# Altium schematic sheet Sheet2.SchDoc
size A4; SheetNumber: 2; SheetTotal: 2
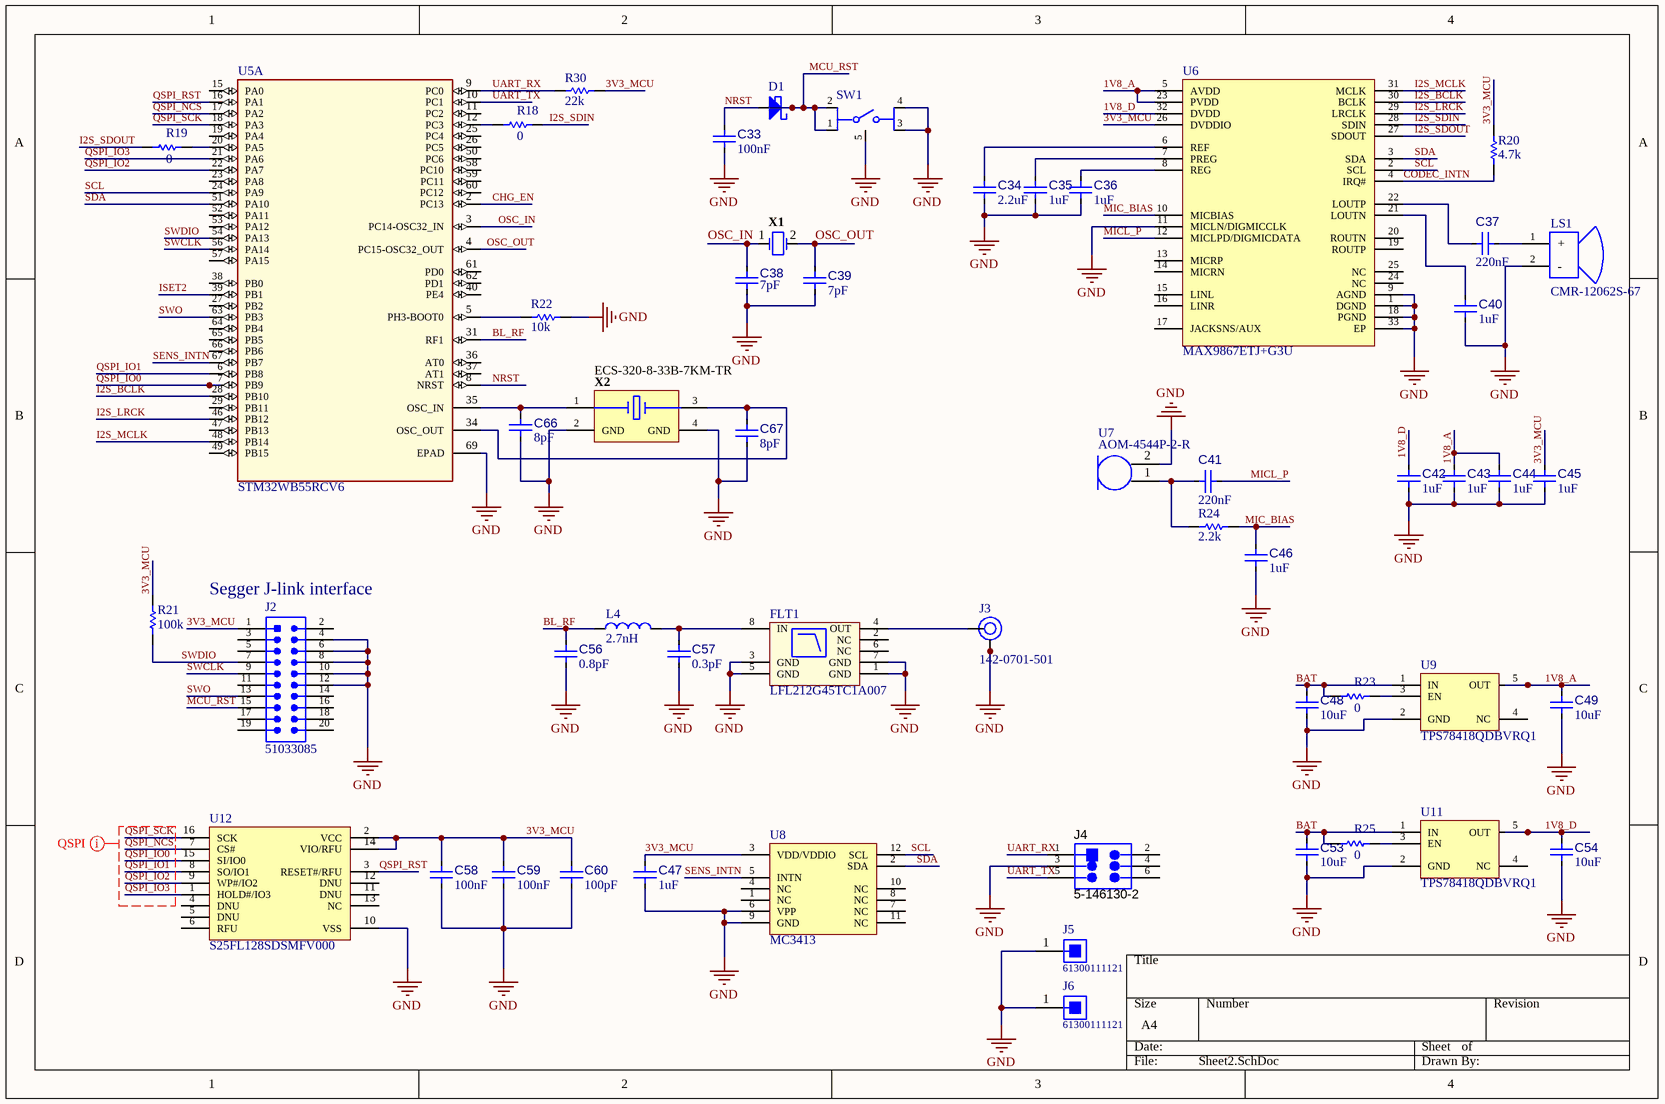
[diagram p0: Sheet2.SchDoc]

## Parts
C33  value 100nF  [0402-SMD-CAP]  (hidden comment: EMF105B7104MVHF)
C34  value 2.2uF  [0603-SMD-CAP]  (hidden comment: GRM188R71A225KE15D)
C35  value 1uF  [0603-SMD-CAP]  (hidden comment: C0603C105K3PACTU)
C36  value 1uF  [0603-SMD-CAP]  (hidden comment: C0603C105K3PACTU)
C37  value 220nF  [0402-SMD-CAP]  (hidden comment: GRM155R71C224KA12D)
C38  value 7pF  [0402-SMD-CAP]  (hidden comment: 04025A7R0CAT2A)
C39  value 7pF  [0402-SMD-CAP]  (hidden comment: 04025A7R0CAT2A)
C40  value 1uF  [0603-SMD-CAP]  (hidden comment: C0603C105K3PACTU)
C41  value 220nF  [0402-SMD-CAP]  (hidden comment: GRM155R71C224KA12D)
C42  value 1uF  [0603-SMD-CAP]  (hidden comment: C0603C105K3PACTU)
C43  value 1uF  [0603-SMD-CAP]  (hidden comment: C0603C105K3PACTU)
C44  value 1uF  [0603-SMD-CAP]  (hidden comment: C0603C105K3PACTU)
C45  value 1uF  [0603-SMD-CAP]  (hidden comment: C0603C105K3PACTU)
C46  value 1uF  [0603-SMD-CAP]  (hidden comment: C0603C105K3PACTU)
C47  value 1uF  [0603-SMD-CAP]  (hidden comment: C0603C105K3PACTU)
C48  value 10uF  [0805-SMD-CAP]  (hidden comment: C0805C106K8PACTU)
C49  value 10uF  [0805-SMD-CAP]  (hidden comment: C0805C106K8PACTU)
C53  value 10uF  [0805-SMD-CAP]  (hidden comment: C0805C106K8PACTU)
C54  value 10uF  [0805-SMD-CAP]  (hidden comment: C0805C106K8PACTU)
C56  value 0.8pF  [0402-SMD-CAP]  (hidden comment: GJM1555C1HR80BB01D)
C57  value 0.3pF  [0402-SMD-CAP]  (hidden comment: GJM1555C1HR30WB01D)
C58  value 100nF  [0603-SMD-CAP]  (hidden comment: CC0603KRX7R9BB104)
C59  value 100nF  [0603-SMD-CAP]  (hidden comment: CC0603KRX7R9BB104)
C60  value 100pF  [0402-SMD-CAP]  (hidden comment: 04025A101JAT2A)
C66  value 8pF  [0402-SMD-CAP]  (hidden comment: CGA2B2C0G1H080D050BA)
C67  value 8pF  [0402-SMD-CAP]  (hidden comment: CGA2B2C0G1H080D050BA)
D1  SS12-E3/61T  [VISH-DO-214AC_V]  (value not drawn)
FLT1  LFL212G45TC1A007  [LFL212G45TC1A007-Footprint-1]
J2  51033085  [51033085-Footprint-1]
J3  142-0701-501  [142-0701-501-Footprint-1]
J4  5-146130-2  [TECO-5-146130-2_V]
J5  61300111121  [61300111121]
J6  61300111121  [61300111121]
L4  Inductance: 2.7nH  [0402-SMD-IND]  (hidden comment: LQG15HS2N7S02D)
LS1  CMR-12062S-67  [CMR-12062S-67-Footprint-1]
R18  value 0  [0603-SMD-RES]  (hidden comment: Jumper 0603)
R19  value 0  [0603-SMD-RES]  (hidden comment: Jumper 0603)
R20  value 4.7k  [0603-SMD-RES]  (hidden comment: ERJ-3EKF4701V)
R21  value 100k  [0603-SMD-RES]  (hidden comment: Resistor 100k +/-1% 0603 100 mW)
R22  value 10k  [0402_SMD_RES]  (hidden comment: CRCW040210K0FKTD)
R23  value 0  [0603-SMD-RES]  (hidden comment: Jumper 0603)
R24  value 2.2k  [0603-SMD-RES]  (hidden comment: CRCW06032K20FKEA)
R25  value 0  [0603-SMD-RES]  (hidden comment: Jumper 0603)
R30  value 22k  [0603-SMD-RES]  (hidden comment: CRCW060322K0FKEA)
SW1  KMR231GLFS  [FP-KMR231GLFS-MFG]  (value not drawn)
U5  STM32WB55RCV6  [QFN40P800X800X100_HS-69N]  (part A of 2)
U6  MAX9867ETJ+G3U  [QFN50P500X500X80_HS-33N]
U7  AOM-4544P-2-R  [AOM-4544P-2-R-Footprint-1]
U8  MC3413  [MC3413 -Footprint-1]
U9  TPS78418QDBVRQ1  [SOT23127P600-8N]
U11  TPS78418QDBVRQ1  [SOT23127P600-8N]
U12  S25FL128SDSMFV000  [SOIC127P1030X265-16M]
X1  ECS-.327-7-12-TR  [ECS-.327-7-12-TR-Footprint-1]  (value not drawn)
X2  ECS-320-8-33B-7KM-TR  [ECS-320-8-33B-7KM-TR-Footprint-1]

## Nets
GND: C33.2 C34.2 C35.2 C36.2 C38.1 C39.1 C40.2 C42.2 C43.2 C44.2 C45.2 C46.2 C47.2 C48.2 C49.2 C53.2 C54.2 C56.2 C57.2 C58.2 C59.2 C60.2 C66.2 C67.2 FLT1.1(GND) FLT1.3(GND) FLT1.5(GND) FLT1.7(GND) J2.4 J2.6 J2.8 J2.10 J2.12 J3.2 J3.3 J3.4 J3.5 J4.3 J5.1 J6.1 LS1.2(-) R22.1 SW1.3 SW1.4 SW1.5(GND) U5.69(EPAD) U6.1(DGND) U6.9(AGND) U6.11(MICLN/DIGMICCLK) U6.18(PGND) U6.33(EP) U7.2(-) U8.6(VPP) U8.9(GND) U9.2(GND) U11.2(GND) U12.10(VSS) X2.2(GND) X2.4(GND)
1V8_A: C43.1 C44.1 C49.1 U6.5(AVDD) U6.23(PVDD) U9.5(OUT)
1V8_D: C42.1 C54.1 U6.32(DVDD) U11.5(OUT)
3V3_MCU: C45.1 C47.1 C58.1 C59.1 C60.1 J2.1 R20.2 R21.2 R30.1 U6.26(DVDDIO) U8.3(VDD/VDDIO) U12.2(VCC) U12.14(VIO/RFU)
BAT: C48.1 C53.1 R23.1 R25.1 U9.1(IN) U11.1(IN)
BL_RF: C56.1 L4.1 U5.31(RF1)
CHG_EN: U5.2(PC13)
CODEC_INTN: R20.1 U6.4(IRQ#)
I2S_BCLK: U5.28(PB10) U6.30(BCLK)
I2S_LRCK: U5.46(PB12) U6.29(LRCLK)
I2S_MCLK: U5.48(PB14) U6.31(MCLK)
I2S_SDIN: R18.2 U6.28(SDIN)
I2S_SDOUT: R19.1 U6.27(SDOUT)
ISET2: U5.39(PB1)
MCU_RST: D1.2(K) J2.15 SW1.1 SW1.2
MIC_BIAS: C46.1 R24.2 U6.10(MICBIAS)
MICL_P: C41.2 U6.12(MICLPD/DIGMICDATA)
NRST: C33.1 D1.1(A) U5.8(NRST)
OSC_IN: C38.2 U5.3(PC14-OSC32_IN) X1.1
OSC_OUT: C39.2 U5.4(PC15-OSC32_OUT) X1.2
QSPI_IO0: U5.7(PB9) U12.15(SI/IO0)
QSPI_IO1: U5.6(PB8) U12.8(SO/IO1)
QSPI_IO2: U5.22(PA7) U12.9(WP#/IO2)
QSPI_IO3: U5.21(PA6) U12.1(HOLD#/IO3)
QSPI_NCS: U5.17(PA2) U12.7(CS#)
QSPI_RST: U5.16(PA1) U12.3(RESET#/RFU)
QSPI_SCK: U5.18(PA3) U12.16(SCK)
SCL: U5.24(PA9) U6.2(SCL) U8.12(SCL)
SDA: U5.51(PA10) U6.3(SDA) U8.2(SDA)
SENS_INTN: U5.67(PB7) U8.5(INTN)
SWCLK: J2.9 U5.56(PA14)
SWDIO: J2.7 R21.1 U5.54(PA13)
SWO: J2.13 U5.63(PB3)
UART_RX: J4.1 R30.2 U5.9(PC0)
UART_TX: J4.5 U5.10(PC1)
NetC34_1: C34.1 U6.6(REF)
NetC35_1: C35.1 U6.7(PREG)
NetC36_1: C36.1 U6.8(REG)
NetC37_1: C37.1 U6.22(LOUTP)
NetC37_2: C37.2 LS1.1(+)
NetC40_1: C40.1 U6.21(LOUTN)
NetC41_1: C41.1 R24.1 U7.1(+)
NetC57_1: C57.1 FLT1.8(IN) L4.2
NetC66_1: C66.1 U5.35(OSC_IN) X2.1(X1)
NetC67_1: C67.1 U5.34(OSC_OUT) X2.3(X2)
NetFLT1_4: FLT1.4(OUT) J3.1
NetR18_1: R18.1 U5.12(PC3)
NetR19_2: R19.2 U5.20(PA5)
NetR22_2: R22.2 U5.5(PH3-BOOT0)
NetR23_2: R23.2 U9.3(EN)
NetR25_2: R25.2 U11.3(EN)

Not connected (* = marked no-connect by the designer): FLT1 2(NC) 6(NC); J2 2 3 5 11 14 16 17 18 19 20; J4 2 4 6; U5 11(PC2) 15(PA0) 19(PA4) 23(PA8) 25(PC4) 26(PC5) 27(PB2) 29(PB11) 36(AT0) 37(AT1) 38(PB0) 40(PE4) 47(PB13) 49(PB15) 50(PC6) 52(PA11) 53(PA12) 57(PA15) 58(PC10) 59(PC11) 60(PC12) 61(PD0) 62(PD1) 64(PB4) 65(PB5) 66(PB6); U6 13(MICRP) 14(MICRN) 15(LINL) 16(LINR) 17(JACKSNS/AUX) 19(ROUTP) 20(ROUTN) 24(NC) 25(NC); U8 1(NC) 4(NC) 7(NC) 8(NC) 10(NC) 11(NC); U9 4(NC); U11 4(NC); U12 4(DNU) 5(DNU) 6(RFU) 11(DNU) 12(DNU) 13(NC)

## Layout directives
net class QSPI; rule Matched Net Lengths [Tolerance = 10mm]: QSPI_IO0, QSPI_IO1, QSPI_IO2, QSPI_IO3, QSPI_NCS, QSPI_SCK

## Notes on the sheet
- (near J2) Segger J-link interface

## Library data of the parts
C33 = CMP-001-00001-15: Chip Capacitor, 0.1 uF, +/- 5%, 16 V, 0402 (1005 Metric); Voltage Rating: 16V; Capacitor Type: Ceramic; Tolerance: 5%; Case/Package: 0402; Max Operating Temperature: 125°C; RoHS Compliant: True; Pins: 2; Mounting Technology: SM; Mfr. Part No.: EMF105B7104MVHF; Min Operating Temperature: -55°C
C34 = CMP-001-00083-10: CAP CER 2.2UF 10V X7R 0603; Tolerance: 10%; Material: Ceramic; Dielectric: X7R; Capacitance: 2.2uF; Number of Pins: 2; Mount: Surface Mount; RoHS Compliant: Yes; Max Operating Temperature: 125°C; Case/Package: 0603; Package Quantity: 4000; Height: 0.8mm; Voltage: 10V; REACH SVHC: No SVHC; Width: 0.8mm; Voltage Rating: 10V; Case Code (Metric): 1608; Series: GRM; Length: 1.6mm; Thickness: 0.035inch; Packaging: Cut Tape; Min Operating Temperature: -55°C; Case Code (Imperial): 0603; Termination: Standard; Lead Free: Lead Free; Depth: 0.8mm; Weight: 0.000222oz; Voltage Rating (DC): 10V
C35 C36 C40 C42-C47 = CMP-001-00097-4: KEMET - C0603C105K3PACTU - SMD Multilayer Ceramic Capacitor, 1 µF, 25 V, 0603 [1608 Metric], ± 10%, X5R, C Series KEMET; Voltage: 25V; Case/Package: 0603; REACH SVHC: No SVHC; Mount: Surface Mount,PCB; Tolerance: 10%; Number of Pins: 2; Case Code (Imperial): 0603; Package Quantity: 4000; Max Operating Temperature: 85°C; Case Code (Metric): 1608; Construction: Flat; Voltage Rating: 25V; Contact Plating: Tin,Matte; Min Operating Temperature: -55°C; Capacitance: 1uF; Termination: SMD/SMT; Radiation Hardening: No; Height: 0.8mm; Packaging: Tape and Reel; Series: C0603C; Depth: 0.8mm; Dielectric Material: Ceramic; Voltage Rating (DC): 25V; Lead Free: Lead Free; Mfr. Part No.: C0603C105K3PACTU; Thickness: 0.034inch; Width: 0.031inch; RoHS Compliant: Yes; Length: 1.6mm; Dielectric: X5R
C37 C41 = CMP-001-00090-11: MURATA - GRM155R71C224KA12D - SMD Multilayer Ceramic Capacitor, 0.22 µF, 16 V, 0402 [1005 Metric], ± 10%, X7R, GRM Series; Voltage Rating: 16V; RoHS Compliant: Yes; REACH SVHC: No SVHC; Case/Package: 0402; Width: 0.02inch; Min Operating Temperature: -55°C; Construction: Flat; Packaging: Tape and Reel; Mount: Surface Mount; Termination: SMD/SMT; Max Operating Temperature: 125°C; Lead Free: Lead Free; Thickness: 0.022inch; Height: 0.5mm; Depth: 0.5mm; Voltage: 16V; Capacitance: 220nF; Material: Ceramic; Tolerance: 10%; Package Quantity: 1; Length: 1mm; Voltage Rating (DC): 16V; Dielectric: X7R; Case Code (Imperial): 0402; Series: GRM; Case Code (Metric): 1005; Radiation Hardening: No
C38 C39 = CMP-001-00007-3: Cap Ceramic 7pF 50V C0G 0.25pF SMD 0402 125C T/R; Temperature Coefficient: 30ppm/°C; Dielectric Material: Ceramic; Dielectric: C0G; Capacitance: 7pF; Length: 1mm; Mfr. Part No.: 04025A7R0CAT2A; Min Operating Temperature: -55°C; Voltage: 50V; Packaging: Tape and Reel; Case Code (Metric): 1005; Thickness: 0.022inch; REACH SVHC: No SVHC; Construction: Flat; Mount: Surface Mount; Width: 0.02inch; Series: -; Package Quantity: 10000; Case/Package: 0402; Max Operating Temperature: 125°C; Voltage Rating: 50V; Radiation Hardening: No; Case Code (Imperial): 0402; Lead Free: Lead Free; Depth: 0.5mm; Termination: SMD/SMT; Voltage Rating (DC): 50V
C48 C49 C53 C54 = CMP-001-00096-2: CAP CER 10UF 10V X5R 0805; Tolerance: 10%; Dielectric Material: Ceramic; Construction: Flat; Case Code (Imperial): 0805; Mount: Surface Mount; Height: 1.25mm; Radiation Hardening: No; Case Code (Metric): 2012; Min Operating Temperature: -55°C; RoHS Compliant: Yes; Voltage Rating: 10V; Dielectric: X5R; Max Operating Temperature: 85°C; Package Quantity: 1; Length: 2mm; Packaging: Tape and Reel; Voltage Rating (DC): 10V; Width: 1.2mm; Dissipation Factor: 10%; Capacitance: 10uF; Case/Package: 0805; Series: C; REACH SVHC: No SVHC; Termination: SMD/SMT; Depth: 1.25mm; Thickness: 0.055inch; Voltage: 10V; Number of Pins: 2; Contact Plating: Tin,Matte
C56 = CMP-001-00009-2: Cap Ceramic 0.8pF 50V C0G 0.1pF SMD 0402 125C Paper T/R; Max Operating Temperature: 125°C; Mount: Surface Mount; Lead Free: Lead Free; Mfr. Part No.: GJM1555C1HR80BB01D; Min Operating Temperature: -55°C; Construction: Flat; Packaging: Tape and Reel; Series: GJM; Dielectric: C0G; Voltage Rating: 50V; Width: 0.02inch; Radiation Hardening: No; Height: 0.5mm; Termination: SMD/SMT; Voltage: 50V; Case Code (Metric): 1005; Length: 1mm; Case Code (Imperial): 0402; Case/Package: 0402; Package Quantity: 1; Depth: 0.5mm; Thickness: 0.022inch; RoHS Compliant: Yes; Capacitance: 0.8pF; Voltage Rating (DC): 50V
C57 = CMP-001-00008-2: Multilayer Ceramic Capacitors MLCC - SMD/SMT 0402 0.3pF 50Volts C0G +/-0.05pF; Voltage Rating: 50V; Packaging: Tape and Reel; Length: 1mm; Case Code (Metric): 1005; Series: GJM; Depth: 0.5mm; Dielectric: C0G; Case Code (Imperial): 0402; Thickness: 0.022inch; Termination: SMD/SMT; Voltage Rating (DC): 50V; Mfr. Part No.: GJM1555C1HR30WB01D; Max Operating Temperature: 125°C; Case/Package: 0402; Mount: Surface Mount; Height: 0.5mm; Radiation Hardening: No; Package Quantity: 10000; Capacitance: 0.3pF; RoHS Compliant: Yes; Min Operating Temperature: -55°C; Lead Free: Lead Free; Construction: Flat; Width: 0.02inch
C58 C59 = CMP-001-00016-2: CAPACITOR CERAMIC, 0.1UF, 50V, X7R, 10%, 0603; Radiation Hardening: No; Depth: 0.8mm; Termination: SMD/SMT; Case Code (Imperial): 0603; Length: 1.6mm; REACH SVHC: No SVHC; Height: 0.8mm; Tolerance: 10%; Package Quantity: 1; Mfr. Part No.: CC0603KRX7R9BB104; Voltage: 50V; Dielectric Material: Ceramic; Voltage Rating: 50V; Max Operating Temperature: 125°C; Case Code (Metric): 1608; Lead Free: Lead Free; Min Operating Temperature: -55°C; RoHS Compliant: Yes; Dielectric: X7R; Number of Pins: 2; Case/Package: 0603; Halogen Free: Halogen Free; Packaging: Tape and Reel; Thickness: 0.035inch; Mount: Surface Mount; Capacitance: 100nF; Series: CC; Width: 0.031inch
C60 = CMP-001-00004-2: Capacitor, Ceramic; 100pf; Chip; Case 0402; Npo; +/-5%; 50wvdc; Smd; 2.5% Df; Tr; Insulation Resistance: 1GR; Temperature Coefficient: 30ppm/°C; Voltage Rating (DC): 50V; Dielectric: C0G; Tolerance: 5%; Radiation Hardening: No; Height: 0.56mm; Dissipation Factor: 2.5%; REACH SVHC: No SVHC; Width: 0.02inch; Construction: Flat; Series: -; Depth: 0.5mm; Packaging: Tape and Reel; Min Operating Temperature: -55°C; Voltage: 50V; Thickness: 0.022inch; Termination: SMD/SMT; Capacitance: 100pF; Mount: Surface Mount,PCB; Voltage Rating: 50V; Max Operating Temperature: 125°C; Package Quantity: 1; Lead Free: Lead Free; Case Code (Imperial): 0402; Length: 1mm; Contact Plating: Tin,Matte; Mfr. Part No.: 04025A101JAT2A; RoHS Compliant: Yes; Case/Package: 0402; Case Code (Metric): 1005
C66 C67 = CMP-001-00014-3: TDK         CGA2B2C0G1H080D050BA             SMD Multilayer Ceramic Capacitor, 0402 [1005 Metric], 8 pF, 50 V,  0.5pF, C0G / NP0, CGA Series; Voltage Rating (DC): 50V; Max Operating Temperature: 125°C; REACH SVHC: No SVHC; Case Code (Imperial): 0402; Series: CGA; Height: 0.5mm; Package Quantity: 10000; Voltage Rating: 50V; Length: 1mm; Mount: Surface Mount; RoHS Compliant: Yes; Resistor Type: Ceramic; Packaging: Tape and Reel; Termination: SMD/SMT; Case Code (Metric): 1005; Thickness: 0.022inch; Min Operating Temperature: -55°C; Weight: 2.3E-05oz; Depth: 0.5mm; Dielectric: C0G; Mfr. Part No.: CGA2B2C0G1H080D050BA; Capacitance: 8pF; Case/Package: 0402; Ratings: AEC-Q200; Width: 0.5mm
D1 = CMP-004-00017-3: Schottky Barrier Rectifier, 20 V, 1 A, -65 to 150 degC, 2-Pin DO-214AC (SMA), RoHS, Tape and Reel; Manufacturer: Vishay Semiconductor; Max Surge Current: 40A; Forward Current: 1A; Forward Voltage: 500mV; Peak Reverse Current: 6mA; Case/Package: SMA; Min Operating Temperature: -65°C; Manufacturer URL: http://www.vishay.com/; Package Reference: DO-214AC (SMA); Max Operating Temperature: 125°C; Packaging: TapeandReel; Datasheet Version: Aug-15; Pins: 2; Datasheet URL: http://www.vishay.com/docs/88746/ss12.pdf; Package Quantity: 1800; Mounting Technology: SM; Package Description: 2-Pin Surface Mount Device, Body 4.245 x 2.665 mm; RoHS Compliant: True
FLT1 = CMP-00004-1: CHIP MULTILAYER LC FILTER; Frequency: 2.45GHz; Max Frequency: 2.5GHz; Impedance: 50R; Min Frequency: 2.4GHz; Shielding: Unshielded; Insertion Loss: 0.5dB; Bandwidth: 50MHz; Series: LFL; Case Code (Imperial): 0805; Number of Pins: 8; REACH SVHC: No SVHC; Width: 1.25mm; Case Code (Metric): 2012; Packaging: Tape and Reel; Package Quantity: 1; RoHS Compliant: Yes; Length: 2mm; Min Operating Temperature: -40°C; Lead Free: Lead Free; Case/Package: 0805; Radiation Hardening: No; Termination: SMD/SMT; Max Operating Temperature: 85°C
J2 = CMP-002-00088-2: CONN HEADER VERT 20POS 2.54MM; Number of Contacts: 20; PCB Mount Alignment: No (Without); Insulation Resistance: 5GR; Max Voltage Rating (AC): 250V; Contact Current Rating: 1A; Mating Alignment: Yes (With); PCB Mount Retention: Without; PCB Mounting Orientation: Vertical; Contact Post Length: 0.12inch; Connector System: Wire-to-Board; Contact Mating Length: 0.24inch; Mount: Through Hole; Connector Type: Header; Mating Connector Lock: No (Without); Height: 8.813mm; Contact Shape: Square; Package Quantity: 35; Contact Plating: Gold,Tin; Max Operating Temperature: 105°C; Housing Color: Black; Current Rating: 1A; Series: AMP-LATCH; Contact Gender: Male; Orientation: Straight; Flammability Rating: UL94 V-0; Depth: 9.14mm; Shrouded: Yes (With); Mating Retention: No (Without); Contact Type: Male Pin; Packaging: Rail/Tube; Voltage Rating: 250V; Number of Rows: 2; Row Spacing: 2.54mm; Color: Black; Contact Material: Copper Alloy; Termination: Through Hole; Number of Positions: 20; Min Operating Temperature: -65°C; Length: 33.02mm; Shrouded End Dimension: 3.81mm; Housing Material: PBT; REACH SVHC: No SVHC; Board Standoff: No (Without); Pitch: 2.54mm; Pins: 20
J3 = CMP-002-00082-3: CONN SMA JACK R/A 50 OHM PCB; Center Contact Plating: Gold; Body Material: Brass; Operating Frequency: 0 to 18 GHz; Max Frequency: 18GHz; Impedance: 50R; Dielectric Material: PTFE; Frequency: 18Hz; Voltage Rating: 335V; Connector Type: SMA,Coaxial; Termination: Solder; Radiation Hardening: No; Max Operating Temperature: 165°C; Mount: Through Hole,Panel,Bulkhead; Min Operating Temperature: -65°C; Body Plating: Gold; Orientation: Right Angle; REACH SVHC: No SVHC; Packaging: Bulk; Type: SMA; Package Quantity: 25; Contact Plating: Gold; Fastening Type: Threaded; Series: SMA; Housing Color: Gold; Length: 19.69mm; Contact Material: Copper; Case/Package: SMA
J4 = CMP-002-00018-5: Male Header, Pitch 2.54 mm, 2 x 3 Position, Height 8.13 mm, -65 to 125 degC, RoHS, Tube; Manufacturer: TE Connectivity; RoHS Compliant: Unknown; Manufacturer URL: http://www.te.com/; Min Operating Temperature: -65°C; Package Reference: 5-146130-2; Package Description: Male Header, Pitch 2.54 mm, 2 x 3 Position, Height 8.13 mm; Gender: Male; Mounting Technology: SM; Datasheet URL: http://www.te.com/commerce/DocumentDelivery/DDEController?Action=showdoc&DocId=Customer+Drawing%7F146130%7FM%7Fpdf%7FEnglish%7FENG_CD_146130_M.pdf%7F5-146130-2; Datasheet Version: Oct-15; Connector Type: Header; Case/Package: 5-146130-2; Max Operating Temperature: 125°C
J5 J6 = CMP-002-00089-2: CONN HEADER VERT 1POS; Number of Contacts: 1; Gender: Male; REACH SVHC: Unknown; Packaging: Bulk; Color: Black; Contact Plating: Gold; Contact Mating Length: 0.236inch; Number of Rows: 1; Termination: Solder; Mfr. Part No.: 61300111121; Pins: 1; Connector Type: Header; Number of Positions: 1; Contact Material: Copper; Mount: Through Hole
L4 = CMP-006-00031-2: MURATA - LQG15HS2N7S02D - INDUCTOR, 2.7NH, 0.8A, 0402, MULTILAYER; Self Resonant Frequency: 6GHz; Test Frequency: 100MHz; DC Current: 300mA; Q Factor: 8; Shielding: Unshielded; DC Resistance (DCR): 150mR; Core Material: Air; Lead Free: Lead Free; Mfr. Part No.: LQG15HS2N7S02D; RoHS Compliant: Yes; Height - Seated (Max): 0.022inch; Case/Package: 0402; Value: 2.7nH; Max DC Current: 300mA; Series: LQG15HS; Case Code (Metric): 1005; Military Standard: Not; Current Rating: 300mA; Rated Current-Max: 300mA; Termination: SMD/SMT; Mount: Surface Mount; Height: 0.5mm; Packaging: Tape and Reel; Package Quantity: 10000; Max Operating Temperature: 125°C; Case Code (Imperial): 0402; Length: 1mm; Min Operating Temperature: -55°C; Depth: 0.55mm; Width: 0.5mm; Radiation Hardening: No
LS1 = CMP-00027-00003-2: SPEAKER, 12 X 6 MM, 2 MM DEEP, M; Manufacturer: CUI Devices; Sound Pressure Level: 120dB; Frequency: 540Hz; IP Rating: IP67; Impedance: 32R; Mfr. Part No.: CMR-12062S-67
R18 R19 R23 R25 = CMP-009-00175-4: Case/Package: 0603; Max Operating Temperature: 155°C; Pins: 2; Min Operating Temperature: -55°C
R20 = CMP-009-00190-3: RESISTOR, 0603, 0.1W, 1%, 4K7; Temperature Coefficient: 100ppm/°C; Voltage Rating: 75V; Max Power Dissipation: 100mW; Contact Plating: Tin; Max Operating Temperature: 155°C; Depth: 0.8mm; Military Standard: Not; Radiation Hardening: No; Mount: Surface Mount; Case/Package: 0603; RoHS Compliant: Yes; Features: Automotive AEC-Q200; Lead Free: Lead Free; Case Code (Metric): 1608; Number of Pins: 2; Min Operating Temperature: -55°C; Length: 1.6mm; Package Quantity: 1; Resistance: 4.7k; Number of Terminations: 2; Termination: SMD/SMT; Series: ERJ; Construction: Rectangular; Resistance Tolerance: 1%; Voltage Rating (DC): 75V; Size Code: 0603; Width: 0.031inch; REACH SVHC: No SVHC; Power Rating: 100mW; Packaging: Tape and Reel; Resistor Type: Thick Film; Height: 0.022inch; Weight: 7.1E-05oz; Tolerance: 1%; Case Code (Imperial): 0603
R21 = CMP-009-00023-8: Chip Resistor, 100 KOhm, +/- 1%, 0.1 W, -55 to 155 degC, 0603 (1608 Metric); Voltage Rating: 50V; Power: 100mW; Resistance: 100k; Case/Package: 0603; Min Operating Temperature: -55°C; Tolerance: 1%; Max Operating Temperature: 155°C; RoHS Compliant: True; Pins: 2; Mounting Technology: SM
R22 = CMP-009-00149-12: Chip Resistor, 10 kOhms, +/-1 %, 63 mW, -55 to 125 degC, 0402; Power: 63mW; Tolerance: 1%; Case/Package: 0402; Pins: 2; Mfr. Part No.: CRCW040210K0FKTD; Max Operating Temperature: 155°C; Min Operating Temperature: -55°C
R24 = CMP-009-00006-3: SMD Resistor, Thick film 2.2 kOhm,  ±  1 %, 0603, CRCW06032K20FKEA, Vishay; Resistance: 2.2kR; Voltage Rating: 75V; Temperature Coefficient: 100ppm/°C; Tolerance: 1%; Power Rating: 100mW; Width: 0.033inch; REACH SVHC: Unknown; Number of Terminations: 2; Case/Package: 0603; Military Standard: Not; Mount: Surface Mount; Resistor Type: Thick Film; Size Code: 0603; Features: Automotive AEC-Q200; Weight: 7.1E-05oz; Termination: SMD/SMT; Technology: THICK FILM; Lead Free: Lead Free; Packaging: Tape and Reel; Height: 0.45mm; Case Code (Metric): 1608; Max Power Dissipation: 100mW; Min Operating Temperature: -55°C; Contact Plating: Tin; Construction: Rectangular; Length: 1.55mm; Resistance Tolerance: 1%; Max Operating Temperature: 155°C; Radiation Hardening: No; Series: CRCW; Mfr. Part No.: CRCW06032K20FKEA; Depth: 0.85mm; Voltage Rating (DC): 75V; Case Code (Imperial): 0603; Package Quantity: 10; RoHS Compliant: Yes
R30 = CMP-009-00195-3: VISHAY - CRCW060322K0FKEA - Surface Mount Thick Film Resistor, AEC-Q200 CRCW Series, 22 kohm, 100 mW, - 1%, 75 V RoHS Compliant: Yes; Max Power Dissipation: 100mW; Temperature Coefficient: 100ppm/°C; Resistance: 22kR; Voltage Rating: 75V; Case Code (Metric): 1608; Case Code (Imperial): 0603; Width: 0.85mm; Mount: Surface Mount; Packaging: Tape and Reel; Weight: 7.1E-05oz; RoHS Compliant: Yes; Case/Package: 0603; Termination: SMD/SMT; Number of Terminations: 2; Min Operating Temperature: -55°C; Depth: 0.85mm; Tolerance: 1%; Package Quantity: 10; Features: Automotive AEC-Q200; Construction: Rectangular; Height: 0.45mm; Length: 1.55mm; Technology: THICK FILM; Lead Free: Lead Free; Series: CRCW; REACH SVHC: Unknown; Military Standard: Not; Resistance Tolerance: 1%; Contact Plating: Tin; Resistor Type: Thick Film; Max Operating Temperature: 155°C; Size Code: 0603; Radiation Hardening: No; Voltage Rating (DC): 75V; Power Rating: 100mW
SW1 = CMP-011-00013-2: Switch Tactile N.O. SPST Button Gull Wing 0.05A 32VDC 1VA 150000Cycles 3N SMD T/R; Power Rating: 1W; Max Current Rating: 50mA; Voltage Rating (DC): 32V; Actuator Type: Standard; Contact Resistance: 100mR; Switch Travel: 0.25mm; Switch Function: Off-Mom; Illumination Type: Non-Illuminated,Illuminated; Insulation Resistance: 1GR; Actuator Length: 0.5mm; Contact Material: Silver; Mount: Surface Mount; Depth: 4.6mm; Min Operating Temperature: -40°C; Case/Package: SMD/SMT; Throw Configuration: SPST; Packaging: Cut Tape; Max Operating Temperature: 85°C; Length: 4.6mm; Operating Force: 3N; Width: 2.8mm; Current Rating: 50mA; Package Quantity: 7000; Max Voltage Rating (DC): 32V; Mechanical Life: 150000Cycles; Termination: Gull Wing; Series: KMR2; Contact Plating: Silver; Contact Current Rating: 50mA; Orientation: Straight; REACH SVHC: No SVHC; Lead Free: Lead Free; Radiation Hardening: No
U5 = CMP-020-00023-6: ARM Based Multiprotocol Wireless Microcontroller 32-Bit 1.71V to 3.6V 68-Pin 256KB VFQFPN Surface Mount; Manufacturer: ST; Frequence: 64MHz; Case/Package: VFQFPN; Max Operating Temperature: 85°C; Max Supply Voltage: 3.6V; Min Operating Temperature: -40°C; Min Supply Voltage: 1.71V; Flash size: 256kB
U6 = CMP-001-0002-4: MAX9867 Series 1.8V I2C/Serial Ultra-Low Power Stereo Audio Codec - TQFN-32EP; Sampling Rate: 48KS/s; Interface: I2C,Serial; Resolution: 18b; Signal to Noise Ratio (SNR): 85dB; Number of D/A Converters: 2; Mount: Surface Mount; Operating Supply Voltage: 1.8V; Max Operating Temperature: 85°C; Type: General Purpose; Packaging: Rail/Tube; Package Quantity: 60; Min Operating Temperature: -40°C; Mfr. Part No.: MAX9867ETJ+G3U; RoHS Compliant: Yes; Number of Pins: 32
U7 = CMP-00027-00002-3: Microphones 2.2K OHM 9.7mm; Nominal Supply Voltage (DC): 1.5V; Current Rating: 500uA; Output Impedance: 2.2kR; Voltage Rating: 10V; Shape: Circular,Round; Direction: Omnidirectional; Output Type: Analog; Termination: PC Pins; REACH SVHC: No SVHC; Diameter: 9.7mm; Packaging: Bulk; Height: 4.7mm; Depth: 4.5mm; Impedance: 2.2kR; Series: AOM; Operating Supply Current: 500uA; Max Supply Voltage (DC): 10V; RoHS Compliant: Yes; Width: 9.7mm; Mount: Wire; Length: 9.7mm; Package Quantity: 100; Max Supply Voltage: 1.5V
U8 = CMP-00002-2: 3-AXIS Iomt Accelerometer (1.6X1; Manufacturer: MEMSIC; Sensing Axis: X,Y,Z; Acceleration: 2g, 4g, 8g, 12g, 16g; Interface Type: I2C; Type: Accelerometer; Mfr. Part No.: MC3413; Case/Package: VLGA-12
U9 U11 = CMP-019-00061-2: Automotive, 300-mA, low-IQ, high-PSRR, LDO voltage regulator with high accuracy and enable 5-SOT-23 -40 to 150; Manufacturer: Texas Instruments; Output Voltage: 1.8V; Dropout voltage: 115mV; Max Output Current: 300mA; Case/Package: SOT-23; Mfr. Part No.: TPS78418QDBVRQ1
U12 = CMP-019-00062-1: 128-MBIT Cmos 3.0 Volt Flash Memory With 80MHZ Ddr Spi (ser; Memory Type: FLASH,NOR; Interface: SPI,Serial; RoHS Compliant: Yes; Min Operating Temperature: -40°C; Mfr. Part No.: S25FL128SDSMFV001; Case/Package: SOIC; Frequency: 80MHz; Max Operating Temperature: 105°C; Packaging: Tray
X1 = CMP-003-00032-3: CRYSTAL 32.7680KHZ 7PF SMD; Frequency Tolerance: 20ppm; ESR (Equivalent Series Resistance): 90kR; Frequency: 32.768kHz; Height: 0.024inch; RoHS Compliant: Yes; Mount: Surface Mount; Case/Package: SMD/SMT; Packaging: Tape and Reel; Frequency Stability: 20ppm; Series: ECX-12; Max Operating Temperature: 85°C; Lead Pitch: 0.8mm; Load Capacitance: 7pF; Min Operating Temperature: -40°C; Package Quantity: 3000; Length: 0.079inch; Width: 0.047inch; Number of Pins: 2; Termination: SMD/SMT
X2 = CMP-003-00031-3: Crystal 32MHz ±7ppm (Tol) ±10ppm (Stability) 8pF FUND 40Ohm 4-Pin Mini-CSMD T/R; Manufaturer: ECS; Drive Level: 200uW; ESR: 40; Load Capacitance: 8pF; Tolerance: 7ppm; Max Operating Temperature: -20°C; Min Operating Temperature: 70°C; Freqeuncy Tolerance: 10ppm; Case/Package: 3.2x2.5x0.8mm; Frequency: 32MHz